# EAGLE design Control_Board_10 (EAGLE 5.11)
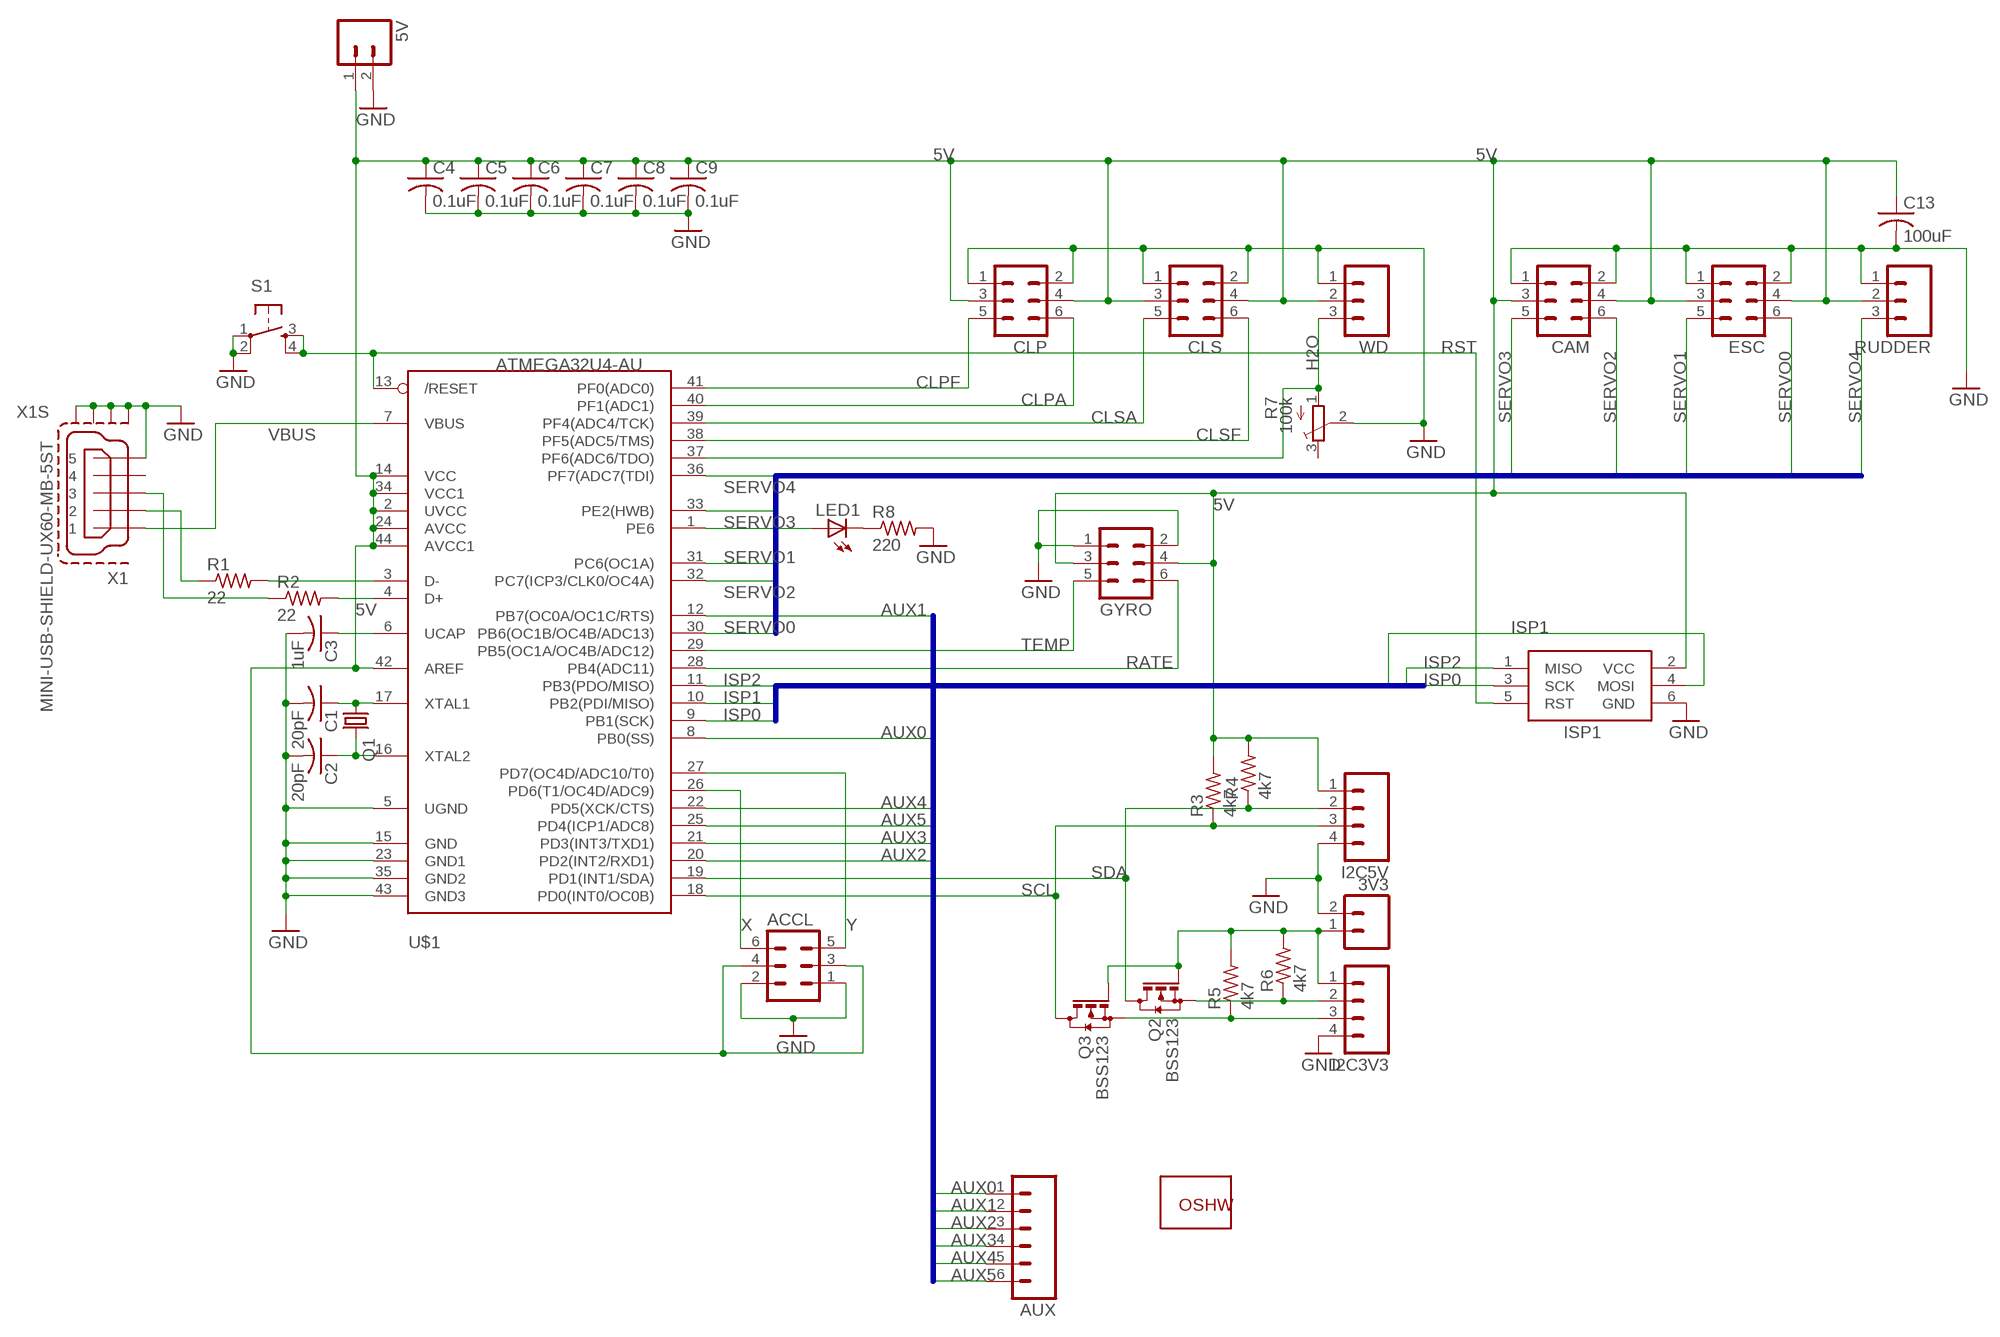
[diagram p0: schematic, sheet 1]

## Parts
3V3  M02PTH  [1X02]
5V  M02PTH  [1X02]
ACCL  MA03-2  [MA03-2]
AUX  M06LOCK  [1X06_LOCK]
C1  20pF  C-US025-025X050  [C025-025X050]
C2  20pF  C-US025-025X050  [C025-025X050]
C3  1uF  C-US025-025X050  [C025-025X050]
C4  0.1uF  C-US025-025X050  [C025-025X050]
C5  0.1uF  C-US025-025X050  [C025-025X050]
C6  0.1uF  C-US025-025X050  [C025-025X050]
C7  0.1uF  C-US025-025X050  [C025-025X050]
C8  0.1uF  C-US025-025X050  [C025-025X050]
C9  0.1uF  C-US025-025X050  [C025-025X050]
C13  100uF  C-US025-025X050  [C025-025X050]
CAM  MA03-2  [MA03-2]
CLP  MA03-2  [MA03-2]
CLS  MA03-2  [MA03-2]
ESC  MA03-2  [MA03-2]
GOLD_ORB_SM1  OSHWLOGO_GOLD_ORB_SM  [OSHW2]
GYRO  MA03-2  [MA03-2]
I2C3V3  M04LOCK  [1X04_LOCK]
I2C5V  M04LOCK  [1X04_LOCK]
ISP1  AVRISP-6  [AVRISP]
LED1  LED3MM  [LED3MM]
Q1  CRYSTALHC49UP  [HC49UP]
Q2  BSS123  [SOT23]
Q3  BSS123  [SOT23]
R1  22  R-US_0204/7  [0204/7]
R2  22  R-US_0204/7  [0204/7]
R3  4k7  R-US_0204/7  [0204/7]
R4  4k7  R-US_0204/7  [0204/7]
R5  4k7  R-US_0204/7  [0204/7]
R6  4k7  R-US_0204/7  [0204/7]
R7  100k  TRIMPOTTC33X  [TC33X]
R8  220  R-US_0204/7  [0204/7]
RUDDER  M03PTH  [1X03]
S1  TAC_SWITCHPTH  [TACTILE-PTH]
U$1  ATMEGA32U4-AU  [TQFP44]
WD  M03PTH  [1X03]
X1  MINI-USB-SHIELD-UX60-MB-5ST  [UX60-MB-5ST]

## Nets
3SCL: I2C3V3.3 Q3.2(S) R5.1
3SDA: I2C3V3.2 Q2.2(S) R6.1
3V3: 3V3.1 I2C3V3.1 Q2.1(G) Q3.1(G) R5.2 R6.2
5V: 5V.1 ACCL.3 ACCL.4 C4.1 C5.1 C6.1 C7.1 C8.1 C9.1 C13.1 CAM.3 CAM.4 CLP.3 CLP.4 CLS.3 CLS.4 ESC.3 ESC.4 GYRO.3 GYRO.4 I2C5V.1 ISP1.2(VCC) R3.2 R4.2 RUDDER.2 U$1.2(UVCC) U$1.14(VCC) U$1.24(AVCC) U$1.34(VCC1) U$1.42(AREF) U$1.44(AVCC1) WD.2
AUX0: AUX.1 U$1.8(PB0(SS))
AUX1: AUX.2 U$1.12(PB7(OC0A/OC1C/RTS))
AUX2: AUX.3 U$1.20(PD2(INT2/RXD1))
AUX3: AUX.4 U$1.21(PD3(INT3/TXD1))
AUX4: AUX.5 U$1.22(PD5(XCK/CTS))
AUX5: AUX.6 U$1.25(PD4(ICP1/ADC8))
CLPA: CLP.6 U$1.40(PF1(ADC1))
CLPF: CLP.5 U$1.41(PF0(ADC0))
CLSA: CLS.5 U$1.39(PF4(ADC4/TCK))
CLSF: CLS.6 U$1.38(PF5(ADC5/TMS))
D+CON: R2.1 X1.3
D+MCU: R2.2 U$1.4(D+)
D-CON: R1.1 X1.2
D-MCU: R1.2 U$1.3(D-)
GND: 3V3.2 5V.2 ACCL.1 ACCL.2 C1.2 C2.2 C3.2 C4.2 C5.2 C6.2 C7.2 C8.2 C9.2 C13.2 CAM.1 CAM.2 CLP.1 CLP.2 CLS.1 CLS.2 ESC.1 ESC.2 GYRO.1 GYRO.2 I2C3V3.4 I2C5V.4 ISP1.6(GND) R7.2(S) R8.2 RUDDER.1 S1.1 S1.2 U$1.5(UGND) U$1.15(GND) U$1.23(GND1) U$1.35(GND2) U$1.43(GND3) WD.1 X1.5 X1.M1(S1) X1.M2(S2) X1.M3(S3) X1.M4(S4)
H2O: R7.1(A) U$1.37(PF6(ADC6/TDO)) WD.3
ISP0: ISP1.3(SCK) U$1.9(PB1(SCK))
ISP1: ISP1.4(MOSI) U$1.10(PB2(PDI/MISO))
ISP2: ISP1.1(MISO) U$1.11(PB3(PDO/MISO))
N$9: LED1.A U$1.1(PE6)
N$28: LED1.K(C) R8.1
RATE: GYRO.6 U$1.28(PB4(ADC11))
RST: ISP1.5(RST) S1.3 S1.4 U$1.13(/RESET)
SCL: I2C5V.3 Q3.3(D) R3.1 U$1.18(PD0(INT0/OC0B))
SDA: I2C5V.2 Q2.3(D) R4.1 U$1.19(PD1(INT1/SDA))
SERVO0: ESC.6 U$1.30(PB6(OC1B/OC4B/ADC13))
SERVO1: ESC.5 U$1.31(PC6(OC1A))
SERVO2: CAM.6 U$1.32(PC7(ICP3/CLK0/OC4A))
SERVO3: CAM.5 U$1.33(PE2(HWB))
SERVO4: RUDDER.3 U$1.36(PF7(ADC7(TDI))
TEMP: GYRO.5 U$1.29(PB5(OC1A/OC4B/ADC12))
UCAP: C3.1 U$1.6(UCAP)
VBUS: U$1.7(VBUS) X1.1
X: ACCL.6 U$1.26(PD6(T1/OC4D/ADC9))
XTAL1: C1.1 Q1.1 U$1.17(XTAL1)
XTAL2: C2.1 Q1.2 U$1.16(XTAL2)
Y: ACCL.5 U$1.27(PD7(OC4D/ADC10/T0))
Unconnected: R7.3(E) X1.4

## Buses
SERVO[0..4]
ISP[0..2]
AUX[0..5]

## Library data of the parts
3V3 5V = SparkFun:M02: Header 2 Standard 2-pin 0.1" header. Use with straight break away headers (SKU : PRT-00116), right angle break away headers (PRT-00553), swiss pins (PRT-00743), machine pins (PRT-00117), and female headers (PRT-00115). Molex polarized connector foot print use with SKU : PRT-08233 with associated crimp pins and housings.
ACCL CAM CLP CLS ESC GYRO = con-lstb:MA03-2: PIN HEADER
AUX = SparkFun:M06: Header 6 Standard 6-pin 0.1" header. Use with straight break away headers (SKU : PRT-00116), right angle break away headers (PRT-00553), swiss pins (PRT-00743), machine pins (PRT-00117), and female headers (PRT-00115). Molex polarized connector foot print use with SKU : PRT-08094 with associated crimp pins and housings. NOTES ON THE VARIANTS LOCK and LOCK_LONGPADS... This footprint was designed to help hold the alignment of a through-hole component (i.e. 6-pin header) while soldering it into place. You may notice that each hole has been shifted either up or down by 0.005 of an inch from it's more standard position (which is a perfectly straight line). This slight alteration caused the pins (the squares in the middle) to touch the edges of the holes. Because they are alternating, it causes a "brace" to hold the component in place. 0.005 has proven to be the perfect amount of "off-center" position when using our standard breakaway headers. Although looks a little odd when you look at the bare footprint, once you have a header in there, the alteration is very hard to notice. Also, if you push a header all the way into place, it is covered up entirely on the bottom side. This idea of altering the position of holes to aid alignment will be further integrated into the Sparkfun Library for other footprints. It can help hold any component with 3 or more connection pins.
C1-C9 C13 = adafruit:C-US: CAPACITOR, American symbol
GOLD_ORB_SM1 = NBitWonder:OSHWLOGO: These are Open-Source Hardware logos.
I2C3V3 I2C5V = SparkFun:M04: Header 4 Standard 4-pin 0.1" header. Use with straight break away headers (SKU : PRT-00116), right angle break away headers (PRT-00553), swiss pins (PRT-00743), machine pins (PRT-00117), and female headers (PRT-00115). Molex polarized connector foot print use with SKU : PRT-08231 with associated crimp pins and housings.
ISP1 = adafruit:AVRISP: AVR ISP HEADER Standard 6 pin header for AVR programming
LED1 = adafruit:LED: LED OSRAM: - CHIPLED LG R971, LG N971, LY N971, LG Q971, LY Q971, LO R971, LY R971 LH N974, LH R974 LS Q976, LO Q976, LY Q976 LO Q996 - Hyper CHIPLED LW Q18S LB Q993, LB Q99A, LB R99A - SideLED LS A670, LO A670, LY A670, LG A670, LP A670 LB A673, LV A673, LT A673, LW A673 LH A674 LY A675 LS A676, LA A676, LO A676, LY A676, LW A676 LS A679, LY A679, LG A679 - Hyper Micro SIDELED® LS Y876, LA Y876, LO Y876, LY Y876 LT Y87S - SmartLED LW L88C, LW L88S LB L89C, LB L89S, LG L890 LS L89K, LO L89K, LY L89K LS L896, LA L896, LO L896, LY L896 - TOPLED LS T670, LO T670, LY T670, LG T670, LP T670 LSG T670, LSP T670, LSY T670, LOP T670, LYG T670 LG T671, LOG T671, LSG T671 LB T673, LV T673, LT T673, LW T673 LH T674 LS T676, LA T676, LO T676, LY T676, LB T676, LH T676, LSB T676, LW T676 LB T67C, LV T67C, LT T67C, LS T67K, LO T67K, LY T67K, LW E67C LS E67B, LA E67B, LO E67B, LY E67B, LB E67C, LV E67C, LT E67C LW T67C LS T679, LY T679, LG T679 LS T770, LO T770, LY T770, LG T770, LP T770 LB T773, LV T773, LT T773, LW T773 LH T774 LS E675, LA E675, LY E675, LS T675 LS T776, LA T776, LO T776, LY T776, LB T776 LHGB T686 LT T68C, LB T68C - Hyper Mini TOPLED® LB M676 - Mini TOPLED Santana® LG M470 LS M47K, LO M47K, LY M47K Source: http://www.osram.convergy.de/
Q1 = crystal:CRYSTAL: CRYSTAL
Q2 Q3 = transistor-small-signal:BSS123: N-CHANNEL MOS FET
R1-R6 R8 = resistor:R-US_: RESISTOR, American symbol
R7 = adafruit:TRIMPOT: SMT trimmer potentiometer part number TC33X http://www.ladyada.net/library/eagle
RUDDER WD = SparkFun:M03: Header 3 Standard 3-pin 0.1" header. Use with straight break away headers (SKU : PRT-00116), right angle break away headers (PRT-00553), swiss pins (PRT-00743), machine pins (PRT-00117), and female headers (PRT-00115). Molex polarized connector foot print use with SKU : PRT-08232 with associated crimp pins and housings.
S1 = SparkFun:TAC_SWITCH: Momentary Switch Button commonly used for reset or general input. Spark Fun Electronics SKU : COM-00097
U$1 = adafruit:ATMEGA32U4: http://www.ladyada.net/library/eagle
X1 = con-hirose:MINI-USB-SHIELD-: MINI USB Connector Source: http://www.hirose.co.jp/cataloge_hp/e24000019.pdf

## Board
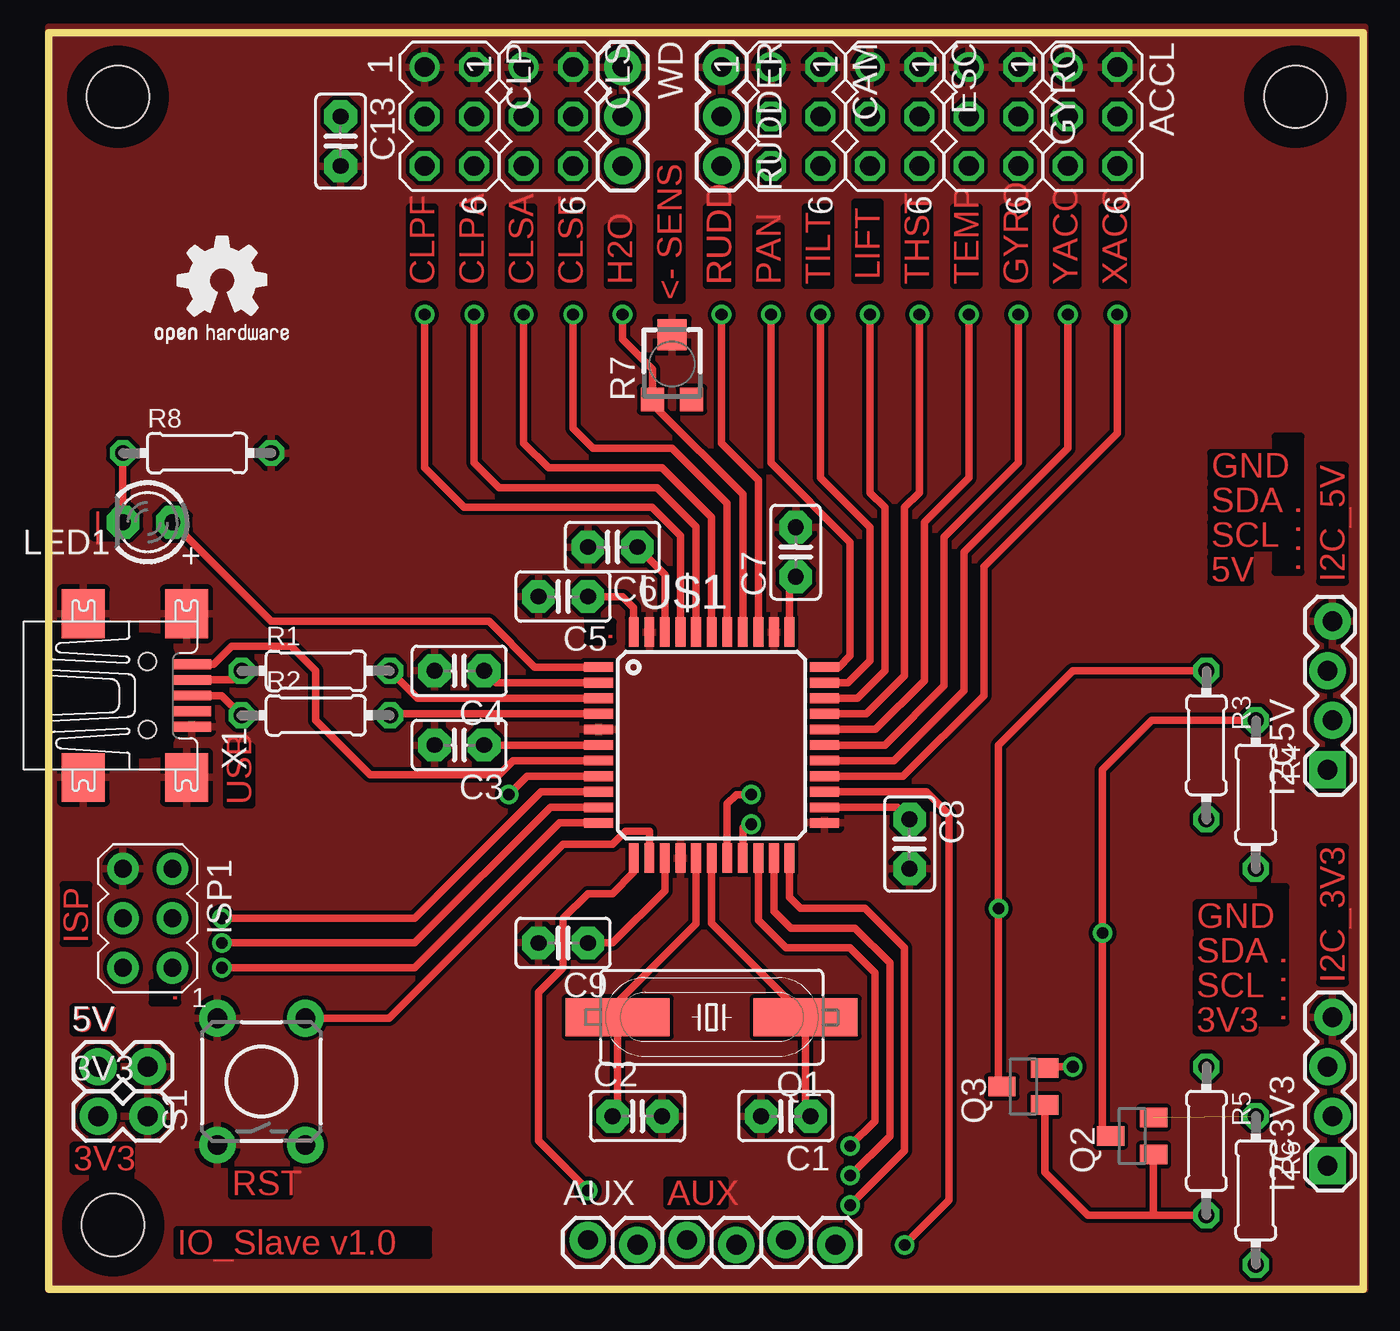
[diagram p1: board, top side]
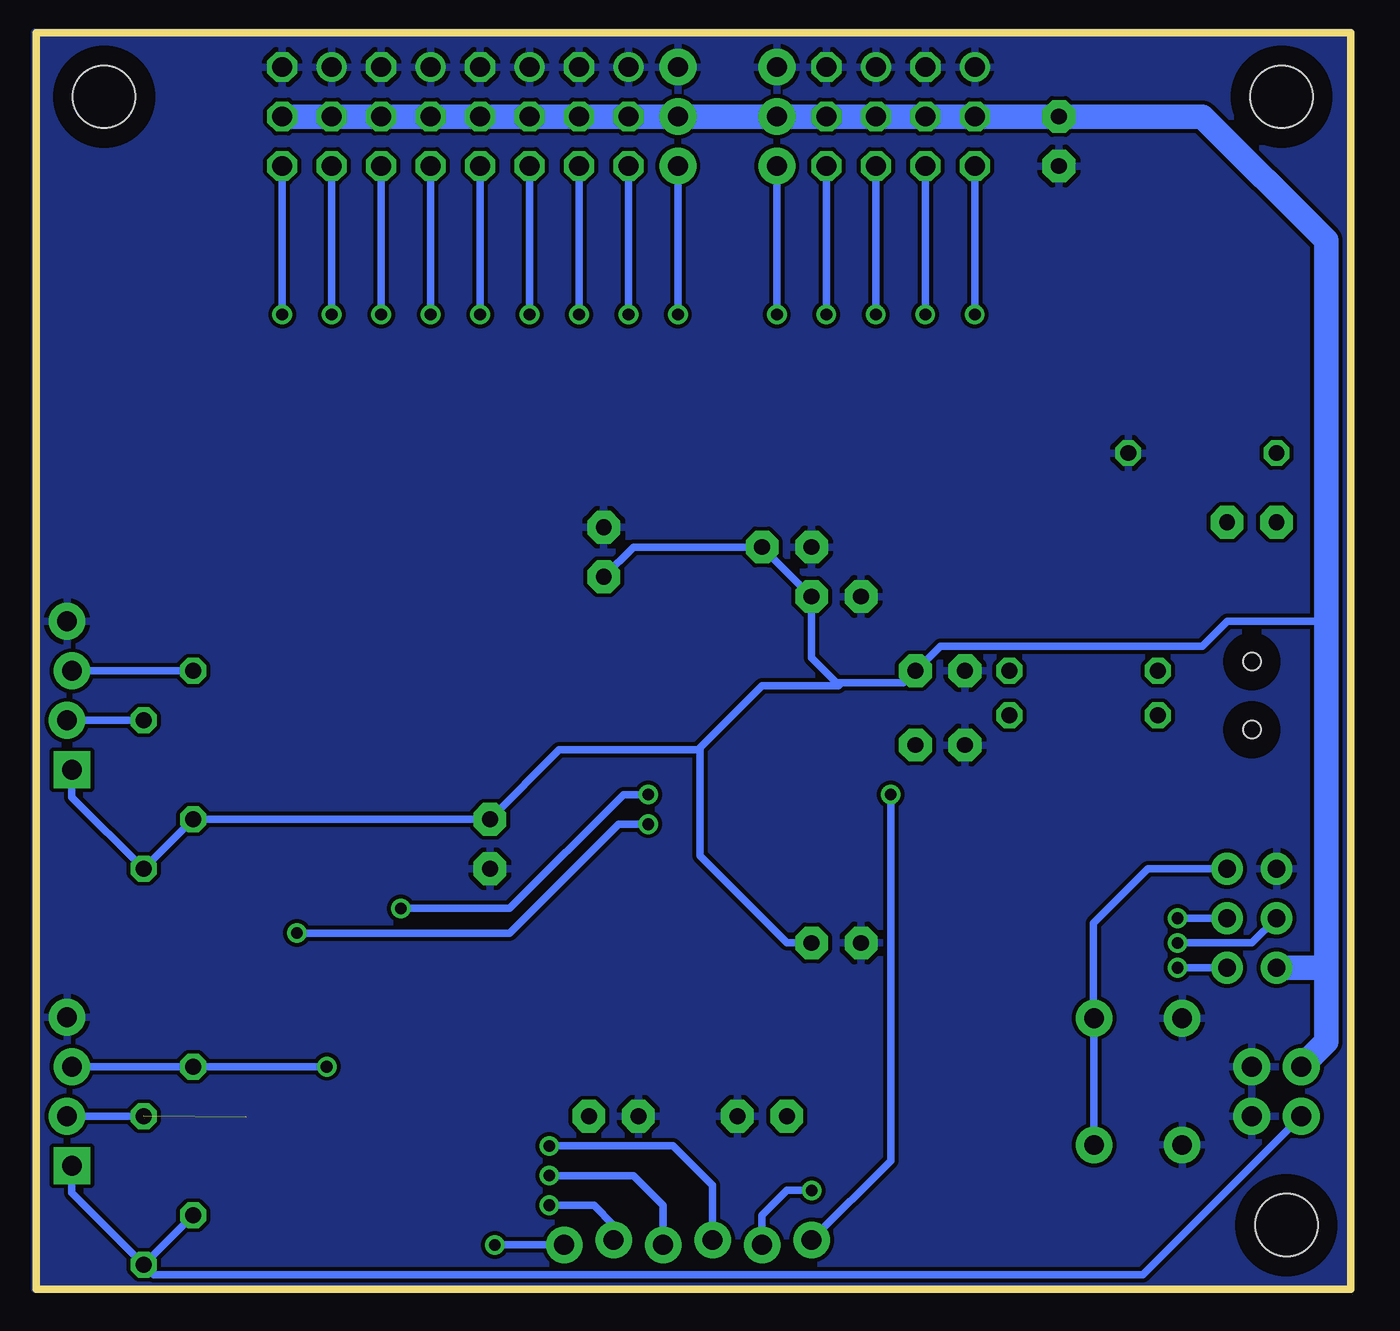
[diagram p2: board, bottom side, seen from below]

No outline drawn. Coordinates in mm, seen from the top.
Copper layers (1*16): Top 0.035mm / dielectric 1.5mm / Bottom 0.035mm
Design rules "default": minimum track width 10mil, minimum drill 24mil, track to track 8mil, track to pad 8mil, pad to pad 8mil, via to via 8mil, smd to smd 8mil, copper to edge 40mil, drill to drill 8mil, minimum pad ring 10mil, minimum via ring 8mil, stop-mask expansion 4mil, vias tented up to drill 0mil, thermal gap 10mil
Holes 3.2 mm at 3.3,3.3 64.01,61.21 3.56,61.21
Milling: 4 lines

### Footprints (pad centres in the part's own frame; a part is rotated, then mirrored left to right if it is on the bottom)
1X02 = drill 1.016 pad 1.88 round: 1 0,0; 2 2.54,0
MA03-2 = drill 1.016 round: 1 -2.54,-1.27 | drill 1.016 octagon: 2 -2.54,1.27; 3 0,-1.27; 4 0,1.27; 5 2.54,-1.27; 6 2.54,1.27
1X06_LOCK = drill 1.016 pad 1.88 round: 1 0,0; 2 2.54,-0.254; 3 5.08,0; 4 7.62,-0.254; 5 10.16,0; 6 12.7,-0.254
C025-025X050 = drill 0.813 pad 1.676 octagon: 1 -1.27,0; 2 1.27,0
1X04_LOCK = drill 1.016 pad 1.88 square: 1 0,0.127 | drill 1.016 pad 1.88 round: 2 2.54,-0.127; 3 5.08,0.127; 4 7.62,-0.127
AVRISP = drill 0.9 pad 1.626 round: 1 -1.27,2.54; 2 1.27,2.54; 3 -1.27,0; 4 1.27,0; 5 -1.27,-2.54; 6 1.27,-2.54
LED3MM = drill 0.813 pad 1.676 octagon: A -1.27,0; K 1.27,0
HC49UP = smd 5.334 x 1.93: 1 -4.826,0; 2 4.826,0
SOT23 = smd 1 x 1.4: 1 -0.95,-1.1; 2 0.95,-1.1; 3 0,1.1
0204/7 = drill 0.813 octagon: 1 -3.81,0; 2 3.81,0
TC33X = smd 1.2 x 1.2: 1 -1,-1.825; 3 1,-1.825 | smd 1.5 x 1.6: 2 0,1.5
1X03 = drill 1.016 pad 1.88 round: 1 0,0; 2 2.54,0; 3 5.08,0
TACTILE-PTH = drill 1.016 pad 1.88 round: 1 -3.251,2.261; 2 3.251,2.261; 3 -3.251,-2.261; 4 3.251,-2.261
TQFP44 = smd 1.5 x 0.5: 1 -5.8,4; 2 -5.8,3.2; 3 -5.8,2.4; 4 -5.8,1.6; 5 -5.8,0.8; 6 -5.8,0; 7 -5.8,-0.8; 8 -5.8,-1.6; 9 -5.8,-2.4; 10 -5.8,-3.2; 11 -5.8,-4; 23 5.8,-4; 24 5.8,-3.2; 25 5.8,-2.4; 26 5.8,-1.6; 27 5.8,-0.8; 28 5.8,0; 29 5.8,0.8; 30 5.8,1.6; 31 5.8,2.4; 32 5.8,3.2; 33 5.8,4 | smd 0.5 x 1.5: 12 -4,-5.8; 13 -3.2,-5.8; 14 -2.4,-5.8; 15 -1.6,-5.8; 16 -0.8,-5.8; 17 0,-5.8; 18 0.8,-5.8; 19 1.6,-5.8; 20 2.4,-5.8; 21 3.2,-5.8; 22 4,-5.8; 34 4,5.8; 35 3.2,5.8; 36 2.4,5.8; 37 1.6,5.8; 38 0.8,5.8; 39 0,5.8; 40 -0.8,5.8; 41 -1.6,5.8; 42 -2.4,5.8; 43 -3.2,5.8; 44 -4,5.8
UX60-MB-5ST = smd 2 x 0.5: 1 2.25,1.6; 2 2.25,0.8; 3 2.25,0; 4 2.25,-0.8; 5 2.25,-1.6 | smd 2.2 x 2.5: M1 -3.3,-4.2; M2 -3.3,4.2; M3 2,4.2; M4 2,-4.2 | hole 0.9: 0,-1.75; 0,1.75

### Placement (x,y rotation side)
3V3  2.54,8.89 0 top
5V  2.54,11.43 0 top
ACCL  53.59,60.2 270 top
AUX  27.69,2.54 0 top
C1  37.85,8.89 180 top
C2  30.23,8.89 0 top
C3  21.08,27.94 180 top
C4  21.08,31.75 180 top
C5  26.42,35.56 180 top
C6  28.96,38.1 180 top
C7  38.35,37.85 90 top
C8  44.2,22.86 270 top
C9  26.42,17.78 180 top
C13  14.99,58.93 270 top
CAM  38.35,60.2 270 top
CLP  20.57,60.2 270 top
CLS  25.65,60.2 270 top
ESC  43.43,60.2 270 top
GOLD_ORB_SM1  5.08,47.5 0 top
GYRO  48.51,60.2 270 top
I2C3V3  65.79,6.35 90 top
I2C5V  65.79,26.67 90 top
ISP1  5.08,19.05 180 top
LED1  5.08,39.37 180 top
Q1  34.04,13.97 180 top
Q2  55.63,7.87 90 top
Q3  50.04,10.41 90 top
R1  13.72,31.75 0 top
R2  13.72,29.46 0 top
R3  59.44,27.94 270 top
R4  61.98,25.4 270 top
R5  59.44,7.62 270 top
R6  61.98,5.08 270 top
R7  32,47.5 0 top
R8  7.62,42.93 0 top
RUDDER  34.54,62.74 270 top
S1  10.92,10.67 90 top
U$1  34.04,27.94 0 top
WD  29.46,62.74 270 top
X1  5.08,30.48 0 top

### Tracks (layer width: path | path; a pad name or v marks a point on that pad's centre or on a via)
3SCL  (via drill 0.6)
  Top 0.381: Q3.2 51.2,11.43 v52.58,11.43
  Bottom 0.381: I2C3V3.3 R5.1 v52.58,11.43
3SDA  (1 unrouted)
  Bottom 0.381: R6.1 I2C3V3.2
3V3
  Top 0.381: Q3.1 51.14,6.01 53.34,3.81 56.64,3.81 | R5.2 56.64,3.81 | Q2.1 56.73,3.89 56.64,3.81
  Bottom 0.381: R6.2 R5.2 | R6.2 61.47,0.76 10.67,0.76 3V3.1 | R6.2 65.66,4.95 I2C3V3.1
5V
  Top 0.381: U$1.2 22.96,31.14 C4.1 | U$1.14 31.64,20.46 28.96,17.78 C9.1 | U$1.24 43.59,24.74 C8.1 | U$1.44 30.04,34.99 29.46,35.56 C5.1 | U$1.42 31.64,36.69 C6.1 | U$1.34 38.04,36.26 C7.1
  Bottom 0.381: 1.27,34.29 6.35,34.29 7.62,33.02 21.08,33.02 C4.1 22.96,31.14 26.16,31.14 | 26.16,31.14 26.42,31.14 27.69,32.41 C5.1 C6.1 36.83,38.1 C7.1 | C9.1 28.96,17.78 33.43,22.25 33.43,27.58 | 33.43,27.58 33.43,27.79 30.23,30.99 26.31,30.99 26.16,31.14 | 33.43,27.58 33.53,27.69 40.64,27.69 C8.1 R3.2 R4.2 65.66,25.27 I2C5V.1
  Bottom 1.27: 5V.1 1.27,12.7 1.27,16.51 | 1.27,16.51 1.27,34.29 1.27,53.85 7.62,60.2 C13.1 CLP.3 CLP.4 CLS.3 CLS.4 WD.2 RUDDER.2 CAM.3 CAM.4 ESC.3 ESC.4 GYRO.3 GYRO.4 ACCL.3 ACCL.4 | 1.27,16.51 ISP1.2
AUX0  (via drill 0.6)
  Top 0.381: U$1.8 24.56,26.34 v23.62,25.4
  Bottom 0.381: v23.62,25.4 23.62,6.6 AUX.1
AUX1  (via drill 0.6)
  Top 0.381: U$1.12 30.04,21.4 28.96,20.32 27.69,20.32 26.42,19.05 26.42,16.51 25.15,15.24 25.15,7.62 v27.69,5.08
  Bottom 0.381: v27.69,5.08 28.96,5.08 30.23,3.81 AUX.2
AUX2  (via drill 0.6)
  Top 0.381: U$1.20 36.44,18.94 37.85,17.53 41.15,17.53 42.42,16.26 42.42,8.64 v41.15,7.37
  Bottom 0.381: v41.15,7.37 34.8,7.37 32.77,5.33 AUX.3
AUX3  (via drill 0.6)
  Top 0.381: U$1.21 37.24,19.41 38.1,18.54 41.4,18.54 43.18,16.76 43.18,7.87 v41.15,5.84
  Bottom 0.381: v41.15,5.84 36.83,5.84 35.31,4.32 AUX.4
AUX4  (via drill 0.6)
  Top 0.381: U$1.22 38.04,20.13 38.61,19.56 41.91,19.56 43.94,17.53 43.94,7.11 v41.15,4.32
  Bottom 0.381: v41.15,4.32 38.86,4.32 37.85,3.3 AUX.5
AUX5  (via drill 0.6)
  Top 0.381: U$1.25 45.07,25.54 46.23,24.38 46.23,4.57 v43.94,2.29
  Bottom 0.381: AUX.6 v43.94,2.29
CLPA  (via drill 0.6)
  Top 0.381: U$1.40 33.24,39.15 31.24,41.15 23.11,41.15 21.84,42.42 v21.84,50.04
  Bottom 0.381: v21.84,50.04 CLP.6
CLPF  (via drill 0.6)
  Top 0.381: U$1.41 32.44,38.68 30.99,40.13 21.34,40.13 19.3,42.16 v19.3,50.04
  Bottom 0.381: v19.3,50.04 CLP.5
CLSA  (via drill 0.6)
  Top 0.381: U$1.39 34.04,39.62 31.5,42.16 25.65,42.16 24.38,43.43 v24.38,50.04
  Bottom 0.381: v24.38,50.04 CLS.5
CLSF  (via drill 0.6)
  Top 0.381: U$1.38 34.84,40.35 32,43.18 27.94,43.18 26.92,44.2 v26.92,50.04
  Bottom 0.381: v26.92,50.04 CLS.6
D+CON
  Top 0.381: X1.3 8.89,30.48 R2.1
D+MCU
  Top 0.381: U$1.4 17.6,29.54 R2.2
D-CON
  Top 0.381: X1.2 9.44,31.28 R1.1
D-MCU
  Top 0.381: U$1.3 18.94,30.34 R1.2
GND
  pour Top: 0,64.77 67.56,64.77 67.56,0 0,0
  pour Bottom: 0,64.52 67.56,64.52 67.56,0 0,0
H2O  (via drill 0.6)
  Top 0.381: v29.46,50.04 29.46,48.77 31,47.23 R7.1 31.24,45.44 31.24,45.21 35.64,40.82 U$1.37
  Bottom 0.381: v29.46,50.04 WD.3
ISP0  (via drill 0.6)
  Top 0.381: v8.89,19.05 18.8,19.05 25.29,25.54 U$1.9
  Bottom 0.381: ISP1.3 v8.89,19.05
ISP1  (via drill 0.6)
  Top 0.381: v8.89,17.78 18.8,17.78 25.76,24.74 U$1.10
  Bottom 0.381: v8.89,17.78 5.08,17.78 ISP1.4
ISP2  (via drill 0.6)
  Top 0.381: v8.89,16.51 18.8,16.51 26.23,23.94 U$1.11
  Bottom 0.381: ISP1.1 v8.89,16.51
N$9
  Top 0.381: U$1.1 24.96,31.94 22.61,34.29 11.43,34.29 LED1.A
N$28
  Top 0.381: LED1.K R8.1
RATE  (via drill 0.6)
  Top 0.381: U$1.28 42.93,27.94 45.97,30.99 45.97,38.61 49.78,42.42 v49.78,50.04
  Bottom 0.381: v49.78,50.04 GYRO.6
RST
  Top 0.381: U$1.13 30.84,23.52 29.62,23.52 28.96,22.86 26.42,22.86 17.48,13.92 S1.4
  Bottom 0.381: S1.3 S1.4 13.21,13.95 13.21,18.8 10.41,21.59 ISP1.5
SCL  (via drill 0.6)
  Top 0.381: Q3.3 48.77,10.58 v48.77,19.56 48.77,27.94 52.58,31.75 R3.1 | U$1.18 34.84,24.93 35.31,25.4 v36.07,25.4
  Bottom 0.381: R3.1 I2C5V.3 | v48.77,19.56 43.18,19.56 37.34,25.4 v36.07,25.4
SDA  (via drill 0.6)
  Top 0.381: Q2.3 54.1,8.3 v54.1,18.29 54.1,26.67 56.64,29.21 R4.1 | U$1.19 35.64,23.7 35.81,23.88 v36.07,23.88
  Bottom 0.381: R4.1 I2C5V.2 | v54.1,18.29 43.18,18.29 37.59,23.88 v36.07,23.88
SERVO0  (via drill 0.6)
  Top 0.381: U$1.30 41.99,29.54 43.94,31.5 43.94,40.13 44.7,40.89 v44.7,50.04
  Bottom 0.381: v44.7,50.04 ESC.6
SERVO1  (via drill 0.6)
  Top 0.381: U$1.31 41.52,30.34 42.93,31.75 42.93,40.13 42.16,40.89 v42.16,50.04
  Bottom 0.381: v42.16,50.04 ESC.5
SERVO2  (via drill 0.6)
  Top 0.381: U$1.32 41.05,31.14 42.16,32.26 42.16,39.12 39.62,41.66 v39.62,50.04
  Bottom 0.381: v39.62,50.04 CAM.6
SERVO3  (via drill 0.6)
  Top 0.381: U$1.33 40.58,31.94 41.15,32.51 41.15,38.35 37.08,42.42 v37.08,50.04
  Bottom 0.381: v37.08,50.04 CAM.5
SERVO4  (via drill 0.6)
  Top 0.381: U$1.36 36.44,41.54 34.54,43.43 v34.54,50.04
  Bottom 0.381: v34.54,50.04 RUDDER.3
TEMP  (via drill 0.6)
  Top 0.381: U$1.29 42.46,28.74 44.96,31.24 44.96,39.37 47.24,41.66 v47.24,50.04
  Bottom 0.381: v47.24,50.04 GYRO.5
UCAP
  Top 0.381: C3.1 U$1.6
VBUS
  Top 0.381: X1.1 8.46,32.08 9.4,33.02 12.45,33.02 13.72,31.75 13.72,29.21 16.51,26.42 23.11,26.42 23.84,27.14 U$1.7
X  (via drill 0.6)
  Top 0.381: U$1.26 43.87,26.34 48.01,30.48 48.01,37.08 54.86,43.94 v54.86,50.04
  Bottom 0.381: v54.86,50.04 ACCL.6
XTAL1
  Top 0.381: C1.1 38.86,9.14 Q1.1 34.04,18.8 U$1.17
XTAL2
  Top 0.381: C2.1 29.21,9.14 Q1.2 29.21,14.73 33.24,18.76 U$1.16
Y  (via drill 0.6)
  Top 0.381: U$1.27 43.4,27.14 46.99,30.73 46.99,37.85 52.32,43.18 v52.32,50.04
  Bottom 0.381: v52.32,50.04 ACCL.5

### Text on the board
Top: CLPF | CLPA | CLSA | CLSF | H2O | RUDD | RUDD | PAN | TILT | LIFT | THST | TEMP | GYRO | YACC | XACC | <- SENS | GND | SDA | | | SCL | . . . . | . . . . | 5V | I2C_5V | . | USB | GND | ISP | SDA | I2C_3V3 | . | SCL | . . . . | . . . . | 5V | 3V3 | 3V3 | RST | AUX | IO_Slave v1.0